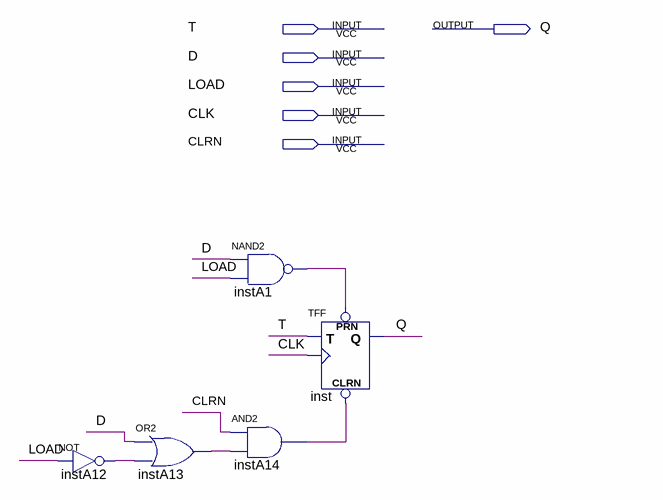
[diagram p0: schematic sheet]
// Quartus schematic OverwritableTFF.bdf as structural Verilog: 5 symbols, 6 pins
module OverwritableTFF (
  input  T,
  input  D,
  input  LOAD,
  input  CLK,
  input  CLRN,
  output Q
);

  wire instA1_out, instA12_out, instA13_out, instA14_out;

  not instA12 (instA12_out, LOAD);
  or instA13 (instA13_out, D, instA12_out);
  nand instA1 (instA1_out, D, LOAD);
  and instA14 (instA14_out, CLRN, instA13_out);
  TFF inst (.PRN(instA1_out), .CLRN(instA14_out), .T(T), .CLK(CLK), .Q(Q));
endmodule
